# EAGLE design Pink-Noise-Generator-Thomas-Henry (EAGLE 7.2.0)
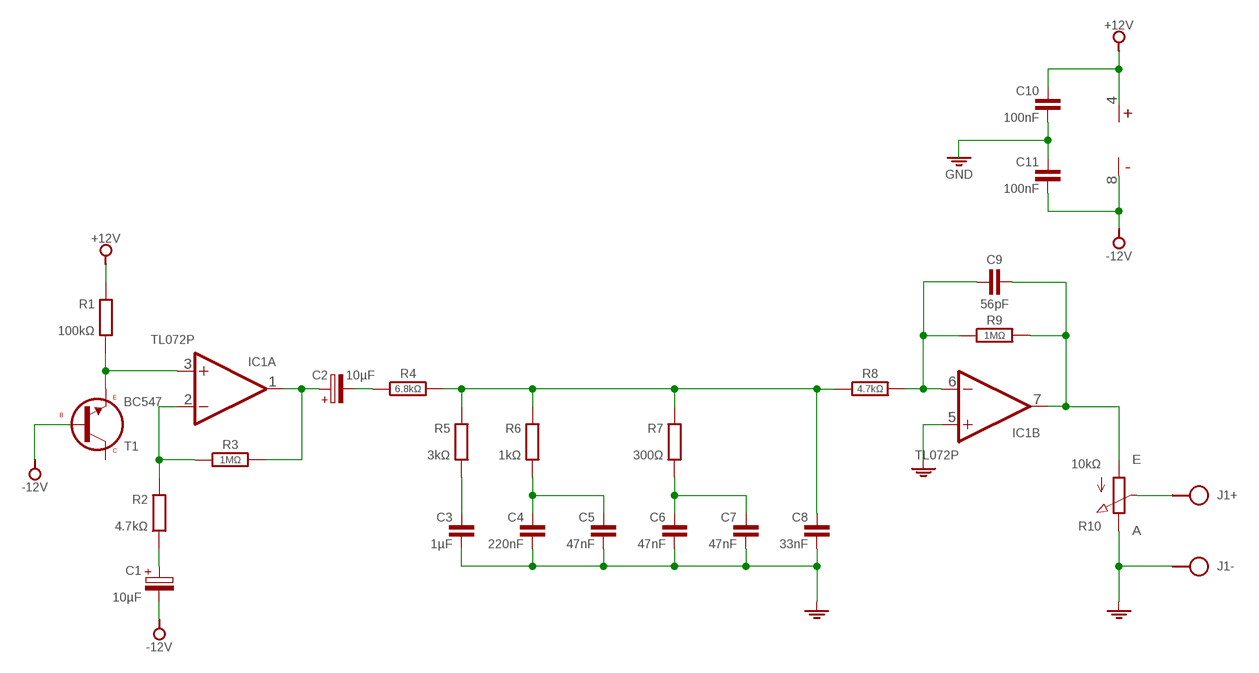
[diagram p0: schematic, sheet 1]

## Parts
C1  10µF  CPOLE2.5-5  [E2,5-5]
C2  10µF  CPOL-HE2,5-5  [E2,5-5]
C3  1µF  C050-020X044/V  [C050-020X044/V]
C4  220nF  C050-020X044/V  [C050-020X044/V]
C5  47nF  C050-020X044/V  [C050-020X044/V]
C6  47nF  C050-020X044/V  [C050-020X044/V]
C7  47nF  C050-020X044/V  [C050-020X044/V]
C8  33nF  C050-020X044/V  [C050-020X044/V]
C9  56pF  C-H050-020X036  [C050-020X036]
C10  100nF  C050-020X044/V  [C050-020X044/V]
C11  100nF  C050-020X044/V  [C050-020X044/V]
IC1  TL072P  [DIL08]
J1  SPAD+-+-  [SPAD+-]
PWR1  -12V_GND_+12V-VCC-VEE  [SPAD-PWR-+GND-]
R1  100kΩ  R0204/10-V  [0204/10-V]
R2  4.7kΩ  R0204/10-V  [0204/10-V]
R3  1MΩ  R-H0204/10  [0204/10]
R4  6.8kΩ  R-H0204/10  [0204/10]
R5  3kΩ  R0204/10-V  [0204/10-V]
R6  1kΩ  R0204/10-V  [0204/10-V]
R7  300Ω  R0204/10-V  [0204/10-V]
R8  4.7kΩ  R-H0204/10  [0204/10]
R9  1MΩ  R-H0204/10  [0204/10]
R10  10kΩ  POT  [POT]
T1  BC547  [TO92]

## Nets
+12V: C10.1 IC1.4(1:+15V) PWR1.VCC R1.1
-12V: C1.- C11.2 IC1.8(1:-15V) PWR1.VEE T1.2(B)
GND: C3.2 C4.2 C5.2 C6.2 C7.2 C8.2 C10.2 C11.1 IC1.5(B:+IN) J1.1 PWR1.GND R10.E
N$1: J1.2 R10.S
N$2: C3.1 R5.2
N$3: C4.1 C5.1 R6.2
N$4: C6.1 C7.1 R7.2
N$5: C8.1 R4.2 R5.1 R6.1 R7.1 R8.1
N$6: C2.- R4.1
N$7: C2.+ IC1.1(A:OUT) R3.2
N$8: C1.+ R2.2
N$9: IC1.2(A:-IN) R2.1 R3.1
N$10: IC1.3(A:+IN) R1.2 T1.3(E)
N$11: C9.1 IC1.6(B:-IN) R8.2 R9.1
N$12: C9.2 IC1.7(B:OUT) R9.2 R10.A
Unconnected: T1.1(C)

## Library data of the parts
C1 = c:CPOL: POLARIZED CAPACITOR, European symbol
C2 = c:CPOL-H
C3-C8 C10 C11 = c:C: CAPACITOR, European symbol
C9 = c:C-H
IC1 = ic:TL072: Low-Noise JFET-Input Operational Amplifiers http://www.ti.com/lit/ds/symlink/tl072.pdf
J1 = pad:SPAD+-
PWR1 = pad:-12V_GND_+12V
R1 R2 R5-R7 = r:R: RESISTOR, European symbol
R3 R4 R8 R9 = r:R-H
R10 = r:POT
T1 = t:BC547

## Board
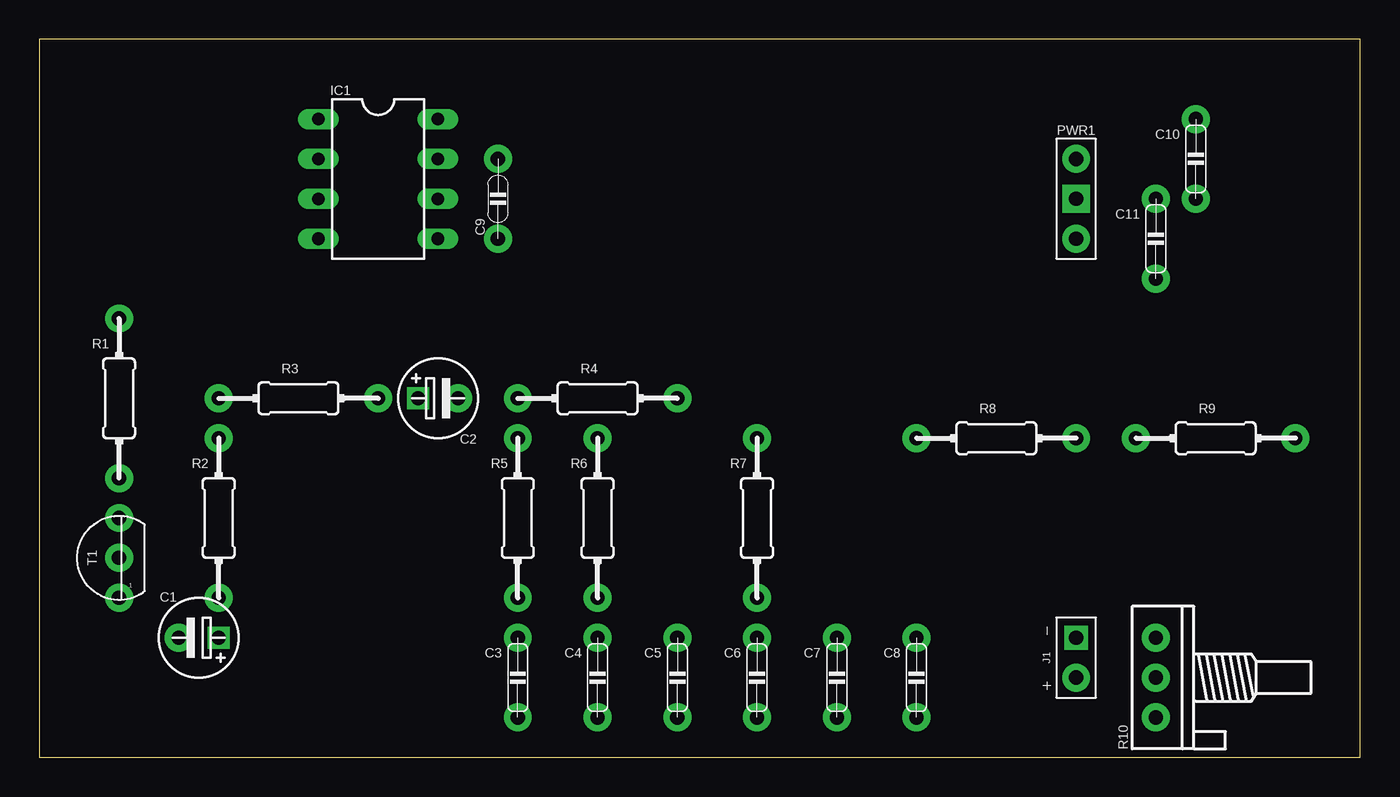
[diagram p1: board, top side]
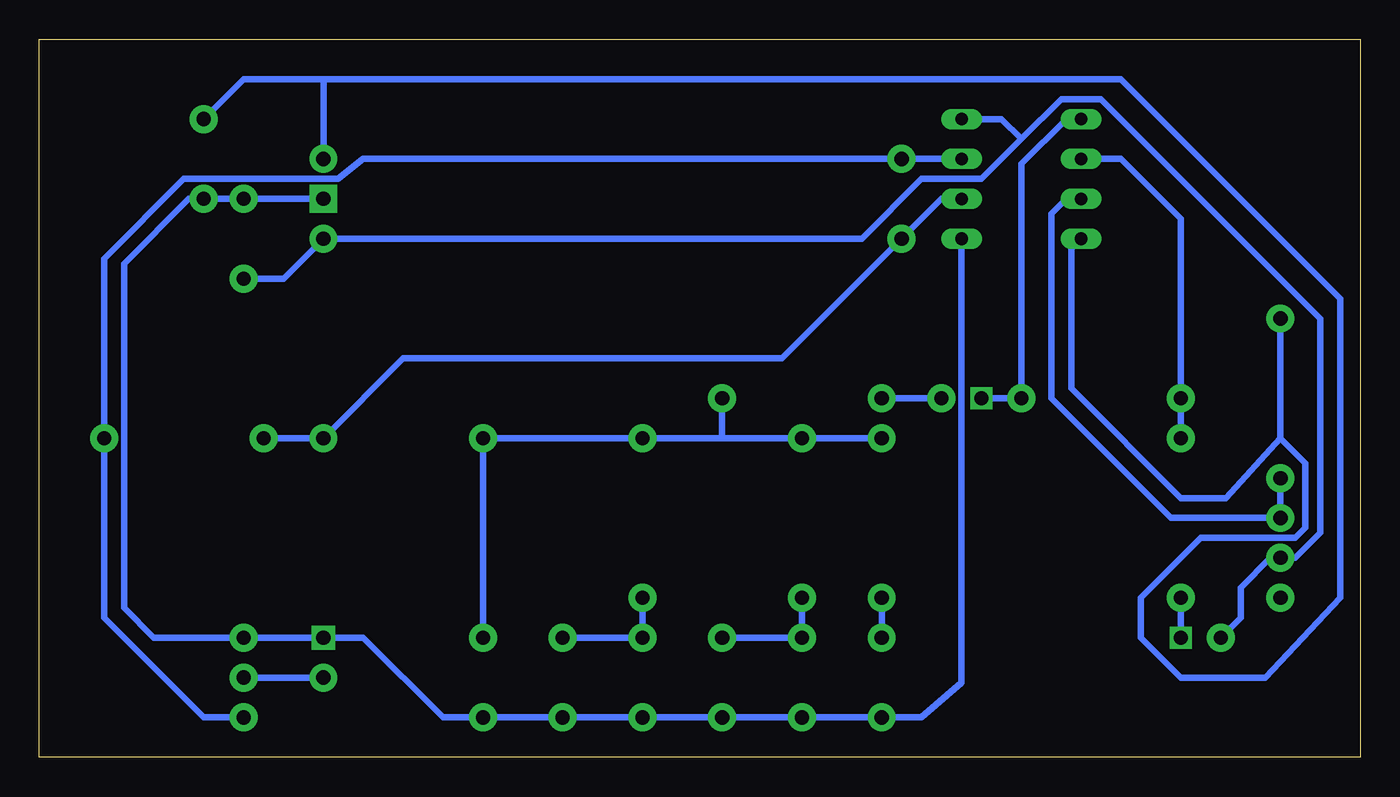
[diagram p2: board, bottom side, seen from below]

Size 84.14 x 45.72 mm. Coordinates in mm from the lower left corner, seen from the top.
Outline: 0,0 84.14,0 84.14,45.72 0,45.72 0,0
Copper layers (1*16): Top 0.035mm / dielectric 1.5mm / Bottom 0.035mm
Design rules "default": minimum track width 10mil, minimum drill 24mil, track to track 8mil, track to pad 8mil, pad to pad 8mil, via to via 8mil, smd to smd 8mil, copper to edge 40mil, drill to drill 8mil, minimum pad ring 10mil, minimum via ring 8mil, stop-mask expansion 4mil, vias tented up to drill 0mil, thermal gap 10mil

### Footprints (pad centres in the part's own frame; a part is rotated, then mirrored left to right if it is on the bottom)
E2,5-5 = drill 0.9 square: + 1.27,0 | drill 0.9 pad 1.778: - -1.27,0
C050-020X044/V = drill 0.9 pad 1.778: 1 0,2.54; 2 0,-2.54
C050-020X036 = drill 0.9 pad 1.778: 1 -2.54,0; 2 2.54,0
DIL08 = drill 0.8 pad 1.27 long: 1 -3.81,3.81; 2 -3.81,1.27; 3 -3.81,-1.27; 4 -3.81,-3.81; 5 3.81,-3.81; 6 3.81,-1.27; 7 3.81,1.27; 8 3.81,3.81
SPAD+- = drill 0.9 pad 1.524 square: 1 0,-1.27 | drill 0.9 pad 1.778: 2 0,1.27
SPAD-PWR-+GND- = drill 0.9 pad 1.778 square: GND 0,0 | drill 0.9 pad 1.778: VCC 0,2.54; VEE 0,-2.54
0204/10-V = drill 0.9 pad 1.778: 1 0,5.08; 2 0,-5.08
0204/10 = drill 0.9 pad 1.778: 1 -5.08,0; 2 5.08,0
POT = drill 0.9 pad 1.778: A -2.54,0; E 2.54,0; S 0,0
TO92 = drill 0.9 pad 1.778: 1 0,2.54; 2 0,0; 3 0,-2.54

### Placement (x,y rotation side)
C1  10.16,7.62 0 top
C2  25.4,22.86 180 top
C3  30.48,5.08 0 top
C4  35.56,5.08 0 top
C5  40.64,5.08 0 top
C6  45.72,5.08 0 top
C7  50.8,5.08 0 top
C8  55.88,5.08 0 top
C9  29.21,35.56 90 top
C10  73.66,38.1 0 top
C11  71.12,33.02 0 top
IC1  21.59,36.83 0 top
J1  66.04,6.35 180 top
PWR1  66.04,35.56 0 top
R1  5.08,22.86 0 top
R2  11.43,15.24 0 top
R3  16.51,22.86 0 top
R4  35.56,22.86 0 top
R5  30.48,15.24 0 top
R6  35.56,15.24 0 top
R7  45.72,15.24 0 top
R8  60.96,20.32 0 top
R9  74.93,20.32 0 top
R10  71.12,5.08 90 top
T1  5.08,12.7 180 top

### Tracks (layer width: path | path; a pad name or v marks a point on that pad's centre or on a via)
+12V
  Bottom 0.406: C10.1 71.12,43.18 66.04,43.18 | IC1.4 18.41,32.38 18.41,23.5 11.43,16.51 8.57,16.51 5.08,20.32 | R1.1 5.08,20.32 | 66.04,43.18 PWR1.VCC | 66.04,43.18 15.24,43.18 1.27,29.21 1.27,10.16 6.03,5.08 11.43,5.08 13.97,7.62 13.97,10.16 10.16,13.97 4.13,13.97 3.49,14.61 3.49,18.73 5.08,20.32
-12V
  Bottom 0.406: C11.2 68.58,30.48 PWR1.VEE 31.75,33.02 27.94,36.83 24.13,36.83 21.59,39.37 | 21.59,39.37 19.05,41.91 16.51,41.91 2.54,27.94 2.54,14.29 4.13,12.7 T1.2 5.71,12.7 7.62,10.79 7.62,8.89 C1.- | IC1.8 22.86,40.64 21.59,39.37
GND
  Bottom 0.406: IC1.5 25.4,4.76 27.94,2.54 C3.2 C4.2 C5.2 C6.2 C7.2 C8.2 58.42,2.54 63.5,7.62 J1.1 R10.E 76.83,7.62 78.74,9.53 78.74,31.43 74.61,35.56 C10.2 C11.1 PWR1.GND
N$1
  Bottom 0.406: R10.S J1.2
N$2
  Bottom 0.406: R5.2 C3.1
N$3
  Bottom 0.406: R6.2 C4.1 C5.1
N$4
  Bottom 0.406: R7.2 C6.1 C7.1
N$5
  Bottom 0.406: C8.1 R8.1 R7.1 40.64,20.32 | R5.1 R6.1 40.64,20.32 | 40.64,20.32 R4.2
N$6
  Bottom 0.406: R4.1 C2.-
N$7
  Bottom 0.406: IC1.1 18.73,40.64 21.59,37.78 R3.2 C2.+
N$8
  Bottom 0.406: R2.2 C1.+
N$9
  Bottom 0.406: IC1.2 15.24,38.1 11.43,34.29 R3.1 R2.1
N$10
  Bottom 0.406: IC1.3 18.73,35.56 19.68,34.61 19.68,22.86 12.06,15.24 T1.3 R1.2
N$11
  Bottom 0.406: R9.1 R8.2 60.96,25.4 36.83,25.4 C9.1 26.67,35.56 IC1.6
N$12
  Bottom 0.406: R10.A 73.66,2.54 80.01,8.89 R9.2 80.01,31.75 74.93,36.83 65.09,36.83 63.5,38.1 C9.2 IC1.7